# EAGLE design Teensy3.2_v2 (EAGLE 7.6.0)
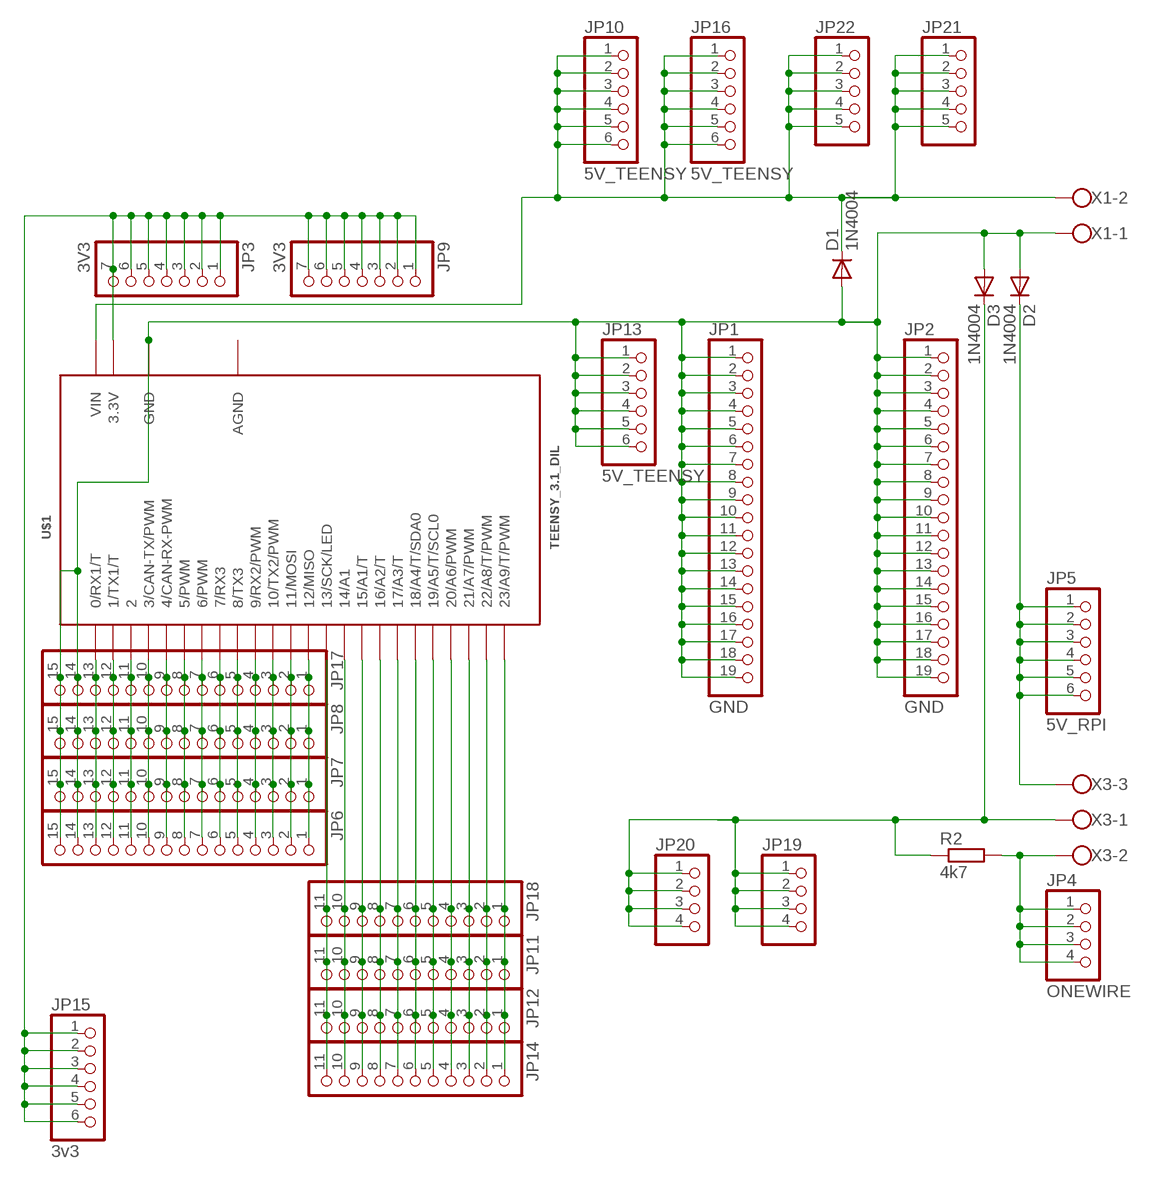
[diagram p0: schematic, sheet 1]

## Parts
D1  1N4004  [DO41-10]
D2  1N4004  [DO41-10]
D3  1N4004  [DO41-10]
JP1  GND  PINHD-1X19  [1X19]
JP2  GND  PINHD-1X19  [1X19]
JP3  3V3  PINHD-1X7  [1X07]
JP4  ONEWIRE  PINHD-1X4  [1X04]
JP5  5V_RPI  PINHD-1X6  [1X06]
JP6  PINHD-1X15  [1X15]
JP7  PINHD-1X15  [1X15]
JP8  PINHD-1X15  [1X15]
JP9  3V3  PINHD-1X7  [1X07]
JP10  5V_TEENSY  PINHD-1X6  [1X06]
JP11  PINHD-1X11  [1X11]
JP12  PINHD-1X11  [1X11]
JP13  5V_TEENSY  PINHD-1X6  [1X06]
JP14  PINHD-1X11  [1X11]
JP15  3v3  PINHD-1X6  [1X06]
JP16  5V_TEENSY  PINHD-1X6  [1X06]
JP17  PINHD-1X15  [1X15]
JP18  PINHD-1X11  [1X11]
JP19  PINHD-1X4  [1X04]
JP20  PINHD-1X4  [1X04]
JP21  PINHD-1X5  [1X05]
JP22  PINHD-1X5  [1X05]
R2  4k7  R-EU_0204/5  [0204/5]
U$1  TEENSY_3.1_DIL  [TEENSY3-DIL]
X1  W237-102  [W237-102]
X3  W237-103  [W237-103]

## Nets
N$1: JP4.1 JP4.2 JP4.3 JP4.4 R2.2 X3.2
N$2: JP3.1 JP3.2 JP3.3 JP3.4 JP3.5 JP3.6 JP3.7 JP9.1 JP9.2 JP9.3 JP9.4 JP9.5 JP9.6 JP9.7 JP15.1 JP15.2 JP15.3 JP15.4 JP15.5 JP15.6 U$1.3.3V
N$3: D3.C JP19.1 JP19.2 JP19.3 JP19.4 JP20.1 JP20.2 JP20.3 JP20.4 R2.1 X3.1
N$4: D1.C JP10.1 JP10.2 JP10.3 JP10.4 JP10.5 JP10.6 JP16.1 JP16.2 JP16.3 JP16.4 JP16.5 JP16.6 JP21.1 JP21.2 JP21.3 JP21.4 JP21.5 JP22.1 JP22.2 JP22.3 JP22.4 JP22.5 U$1.VIN X1.2
N$5: JP6.13 JP7.13 JP8.13 JP17.13 U$1.0(0/RX1/T)
N$6: D1.A D2.A D3.A JP1.1 JP1.2 JP1.3 JP1.4 JP1.5 JP1.6 JP1.7 JP1.8 JP1.9 JP1.10 JP1.11 JP1.12 JP1.13 JP1.14 JP1.15 JP1.16 JP1.17 JP1.18 JP1.19 JP2.1 JP2.2 JP2.3 JP2.4 JP2.5 JP2.6 JP2.7 JP2.8 JP2.9 JP2.10 JP2.11 JP2.12 JP2.13 JP2.14 JP2.15 JP2.16 JP2.17 JP2.18 JP2.19 JP6.14 JP6.15 JP7.14 JP7.15 JP8.14 JP8.15 JP13.1 JP13.2 JP13.3 JP13.4 JP13.5 JP13.6 JP17.14 JP17.15 U$1.GND X1.1
N$7: JP6.11 JP7.11 JP8.11 JP17.11 U$1.2
N$8: JP6.10 JP7.10 JP8.10 JP17.10 U$1.3(3/CAN-TX/PWM)
N$9: JP6.9 JP7.9 JP8.9 JP17.9 U$1.4(4/CAN-RX-PWM)
N$10: JP6.8 JP7.8 JP8.8 JP17.8 U$1.5(5/PWM)
N$11: JP6.7 JP7.7 JP8.7 JP17.7 U$1.6(6/PWM)
N$12: JP6.6 JP7.6 JP8.6 JP17.6 U$1.7(7/RX3)
N$13: JP6.5 JP7.5 JP8.5 JP17.5 U$1.8(8/TX3)
N$14: JP6.4 JP7.4 JP8.4 JP17.4 U$1.9(9/RX2/PWM)
N$15: JP6.3 JP7.3 JP8.3 JP17.3 U$1.10(10/TX2/PWM)
N$16: JP6.2 JP7.2 JP8.2 JP17.2 U$1.11(11/MOSI)
N$18: JP6.1 JP7.1 JP8.1 JP17.1 U$1.12(12/MISO)
N$19: JP11.11 JP12.11 JP14.11 JP18.11 U$1.13(13/SCK/LED)
N$20: JP11.10 JP12.10 JP14.10 JP18.10 U$1.14/A0(14/A1)
N$21: JP11.9 JP12.9 JP14.9 JP18.9 U$1.15/A1(15/A1/T)
N$22: JP11.8 JP12.8 JP14.8 JP18.8 U$1.16/A2(16/A2/T)
N$23: JP11.7 JP12.7 JP14.7 JP18.7 U$1.17/A3(17/A3/T)
N$24: JP11.6 JP12.6 JP14.6 JP18.6 U$1.18/A4(18/A4/T/SDA0)
N$26: JP11.5 JP12.5 JP14.5 JP18.5 U$1.19/A5(19/A5/T/SCL0)
N$27: JP11.4 JP12.4 JP14.4 JP18.4 U$1.20/A6(20/A6/PWM)
N$28: JP11.3 JP12.3 JP14.3 JP18.3 U$1.21/A7(21/A7/PWM)
N$29: JP11.2 JP12.2 JP14.2 JP18.2 U$1.22/A8(22/A8/T/PWM)
N$30: JP11.1 JP12.1 JP14.1 JP18.1 U$1.23/A9(23/A9/T/PWM)
N$31: D2.C JP5.1 JP5.2 JP5.3 JP5.4 JP5.5 JP5.6 X3.3
N$32: JP6.12 JP7.12 JP8.12 JP17.12 U$1.1(1/TX1/T)

## Power pins joined to a net without a drawn wire
AGND: U$1.AGND

## Library data of the parts
D1-D3 = diode:1N4004: DIODE general purpose rectifier, 1 A
JP1 JP2 = pinhead:PINHD-1X19: PIN HEADER
JP3 JP9 = pinhead:PINHD-1X7: PIN HEADER
JP4 JP19 JP20 = pinhead:PINHD-1X4: PIN HEADER
JP5 JP10 JP13 JP15 JP16 = pinhead:PINHD-1X6: PIN HEADER
JP6-JP8 JP17 = pinhead:PINHD-1X15: PIN HEADER
JP11 JP12 JP14 JP18 = pinhead:PINHD-1X11: PIN HEADER
JP21 JP22 = pinhead:PINHD-1X5: PIN HEADER
R2 = rcl:R-EU_: RESISTOR, European symbol
U$1 = Teensy_3_and_LC_Series_Boards_v1.1:TEENSY_3.1_DIL: Teensy 3.1 or 3.2 in a DIL Layout.
X1 = con-wago-500:W237-102: WAGO SCREW CLAMP; MPN: 237-102; OC_FARNELL: unknown; OC_NEWARK: 70K9898
X3 = con-wago-500:W237-103: WAGO SCREW CLAMP; MPN: 237-103; OC_FARNELL: unknown; OC_NEWARK: 18M7116

## Board
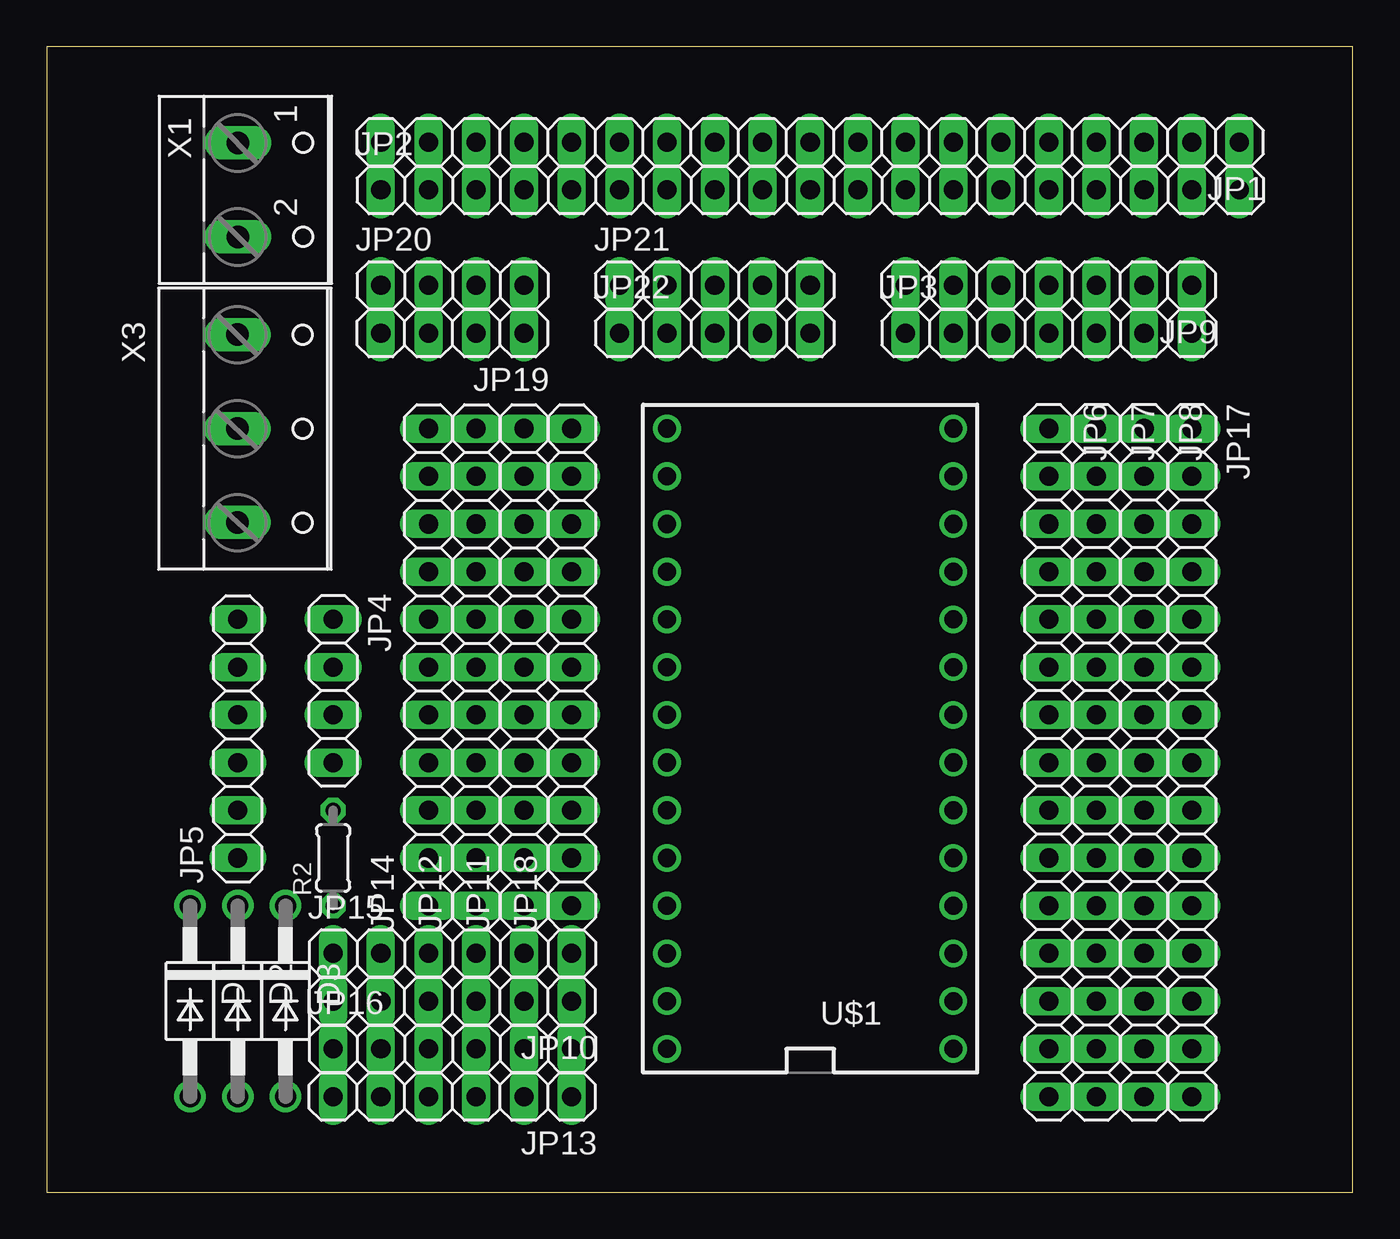
[diagram p1: board, top side]
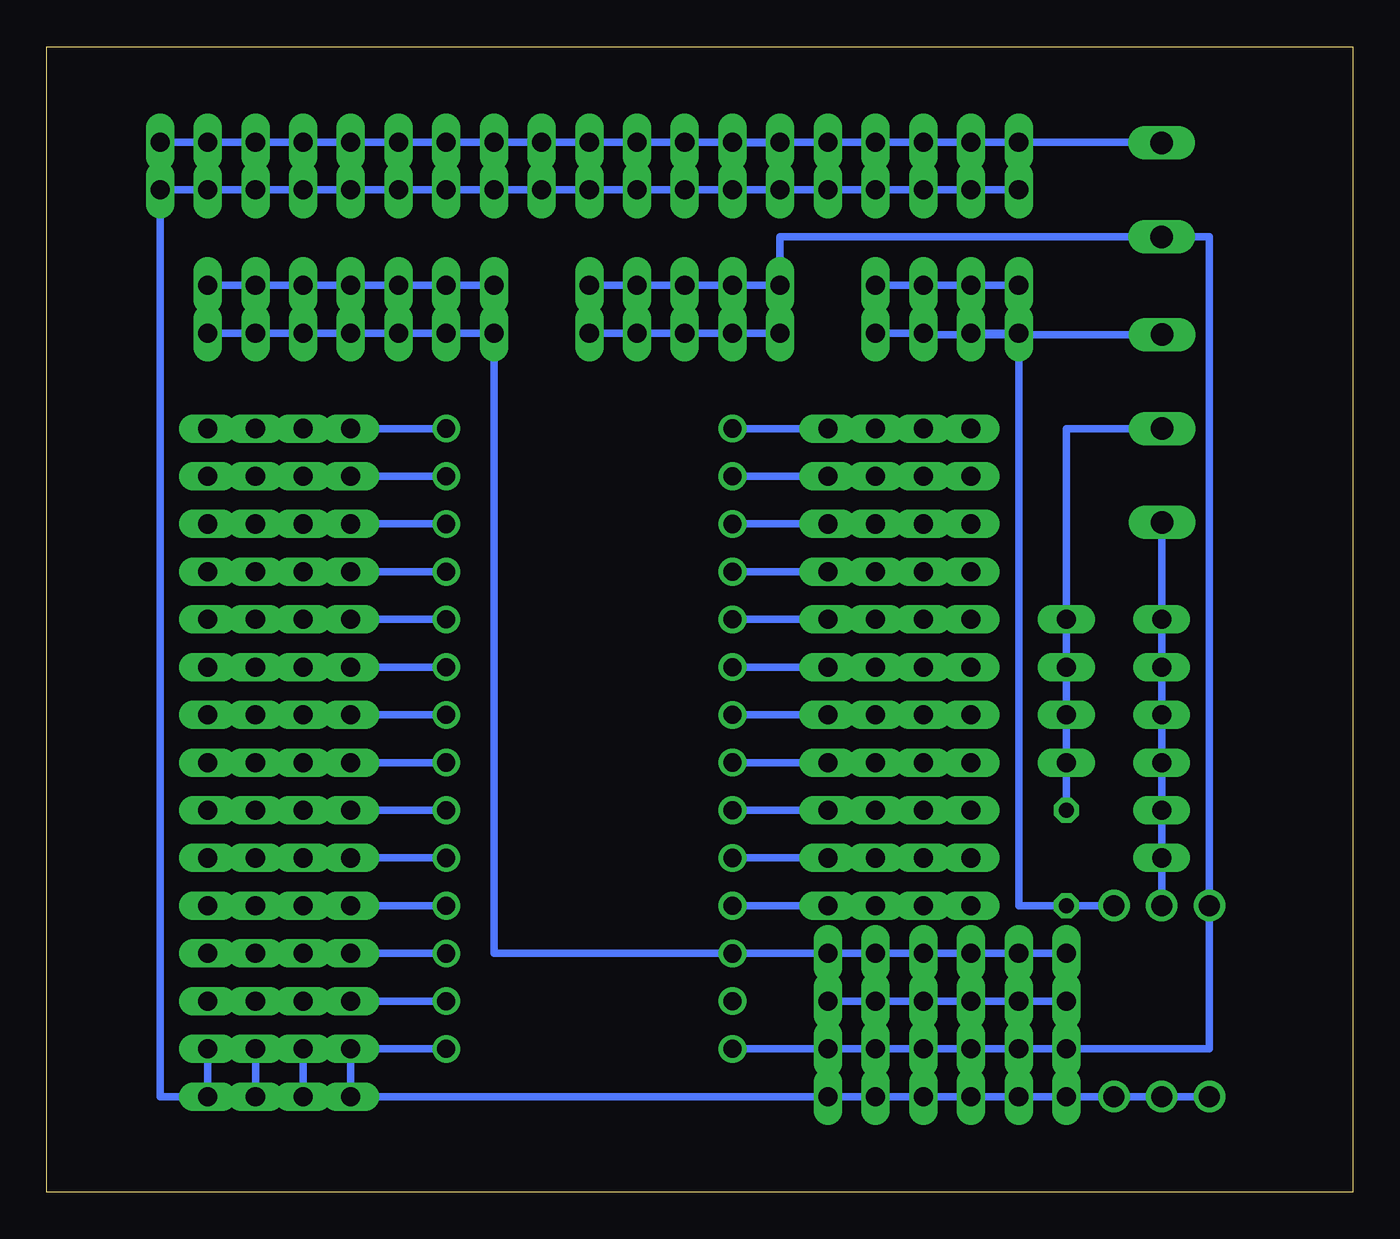
[diagram p2: board, bottom side, seen from below]

Size 69.52 x 60.95 mm. Coordinates in mm from the lower left corner, seen from the top.
Outline: 0,0 69.52,0 69.52,60.95 0,60.95 0,0
Copper layers (1*16): Top 0.035mm / dielectric 1.5mm / Bottom 0.035mm
Design rules "default": minimum track width 10mil, minimum drill 24mil, track to track 8mil, track to pad 8mil, pad to pad 8mil, via to via 8mil, smd to smd 8mil, copper to edge 40mil, drill to drill 8mil, minimum pad ring 10mil, minimum via ring 8mil, stop-mask expansion 4mil, vias tented up to drill 0mil, thermal gap 10mil

### Footprints (pad centres in the part's own frame; a part is rotated, then mirrored left to right if it is on the bottom)
DO41-10 = drill 1.118: A 5.08,0; C -5.08,0
1X19 = drill 1.016 long: 1 -22.86,0; 2 -20.32,0; 3 -17.78,0; 4 -15.24,0; 5 -12.7,0; 6 -10.16,0; 7 -7.62,0; 8 -5.08,0; 9 -2.54,0; 10 0,0; 11 2.54,0; 12 5.08,0; 13 7.62,0; 14 10.16,0; 15 12.7,0; 16 15.24,0; 17 17.78,0; 18 20.32,0; 19 22.86,0
1X07 = drill 1.016 long: 1 -7.62,0; 2 -5.08,0; 3 -2.54,0; 4 0,0; 5 2.54,0; 6 5.08,0; 7 7.62,0
1X04 = drill 1.016 long: 1 -3.81,0; 2 -1.27,0; 3 1.27,0; 4 3.81,0
1X06 = drill 1.016 long: 1 -6.35,0; 2 -3.81,0; 3 -1.27,0; 4 1.27,0; 5 3.81,0; 6 6.35,0
1X15 = drill 1.016 long: 1 -17.78,0; 2 -15.24,0; 3 -12.7,0; 4 -10.16,0; 5 -7.62,0; 6 -5.08,0; 7 -2.54,0; 8 0,0; 9 2.54,0; 10 5.08,0; 11 7.62,0; 12 10.16,0; 13 12.7,0; 14 15.24,0; 15 17.78,0
1X11 = drill 1.016 long: 1 -12.7,0; 2 -10.16,0; 3 -7.62,0; 4 -5.08,0; 5 -2.54,0; 6 0,0; 7 2.54,0; 8 5.08,0; 9 7.62,0; 10 10.16,0; 11 12.7,0
1X05 = drill 1.016 long: 1 -5.08,0; 2 -2.54,0; 3 0,0; 4 2.54,0; 5 5.08,0
0204/5 = drill 0.813 octagon: 1 -2.54,0; 2 2.54,0
TEENSY3-DIL = drill 0.965: 0 -7.62,13.97; 1 -7.62,11.43; 2 -7.62,8.89; 3 -7.62,6.35; 3.3V 7.62,11.43; 4 -7.62,3.81; 5 -7.62,1.27; 6 -7.62,-1.27; 7 -7.62,-3.81; 8 -7.62,-6.35; 9 -7.62,-8.89; 10 -7.62,-11.43; 11 -7.62,-13.97; 12 -7.62,-16.51; 13 7.62,-16.51; 14/A0 7.62,-13.97; 15/A1 7.62,-11.43; 16/A2 7.62,-8.89; 17/A3 7.62,-6.35; 18/A4 7.62,-3.81; 19/A5 7.62,-1.27; 20/A6 7.62,1.27; 21/A7 7.62,3.81; 22/A8 7.62,6.35; 23/A9 7.62,8.89; AGND 7.62,13.97; GND -7.62,16.51; VIN 7.62,16.51
W237-102 = drill 1.194 long: 1 -2.5,-1.27; 2 2.5,-1.27
W237-103 = drill 1.194 long: 1 -5,-1.29; 2 0,-1.29; 3 5,-1.29

### Placement (x,y rotation side)
D1  7.62,10.16 270 top
D2  10.16,10.16 270 top
D3  12.7,10.16 270 top
JP1  40.64,55.88 180 top
JP2  40.64,53.34 0 top
JP3  53.34,45.72 0 top
JP4  15.24,26.67 270 top
JP5  10.16,24.13 90 top
JP6  53.34,22.86 270 top
JP7  55.88,22.86 270 top
JP8  58.42,22.86 270 top
JP9  53.34,48.26 180 top
JP10  21.59,10.16 180 top
JP11  25.4,27.94 90 top
JP12  22.86,27.94 90 top
JP13  21.59,5.08 180 top
JP14  20.32,27.94 90 top
JP15  21.59,12.7 0 top
JP16  21.59,7.62 0 top
JP17  60.96,22.86 270 top
JP18  27.94,27.94 90 top
JP19  21.59,45.72 180 top
JP20  21.59,48.26 0 top
JP21  35.56,48.26 0 top
JP22  35.56,45.72 0 top
R2  15.24,17.78 90 top
U$1  40.64,24.13 180 top
X1  11.43,53.34 270 top
X3  11.43,40.64 270 top

### Tracks (layer width: path | path; a pad name or v marks a point on that pad's centre or on a via)
N$1
  Bottom 0.406: X3.2 15.24,40.64 JP4.1 JP4.2 R2.2 JP4.4 JP4.3
N$2
  Bottom 0.406: JP9.7 JP9.6 JP9.5 JP9.4 JP9.3 JP9.2 JP9.1 JP3.7 JP3.6 JP3.5 JP3.4 JP3.3 JP3.2 JP3.1 45.72,12.7 U$1.3.3V JP15.6 JP15.5 JP15.4 JP15.3 JP15.2 JP15.1
N$3
  Bottom 0.406: 10.14,45.72 X3.1 17.78,45.64 | D3.C R2.1 17.78,15.24 17.78,45.64 | 17.78,45.64 JP19.4 | JP19.4 JP20.1 JP20.2 JP20.3 JP20.4 | JP19.4 JP19.3 | 17.78,45.64 22.86,45.64 JP19.2 JP19.1
N$4
  Bottom 0.406: JP16.1 7.62,7.62 D1.C 7.62,50.84 X1.2 30.48,50.84 JP21.1 | U$1.VIN JP16.6 JP16.5 JP16.4 JP16.3 JP16.2 JP16.1 | JP21.1 JP21.2 JP21.3 JP21.4 JP21.5 | JP21.1 JP22.1 JP22.2 JP22.3 JP22.4 JP22.5 | JP16.1 JP10.6 JP10.5 JP10.4 JP10.3 JP10.2 JP10.1
N$5
  Bottom 0.406: U$1.0 JP6.13 JP7.13 JP8.13 JP17.13
N$6
  Bottom 0.406: 33.02,55.84 30.48,55.84 JP1.6 | JP6.14 JP6.15 JP13.1 JP13.2 JP13.3 JP13.4 JP13.5 JP13.6 D3.A D2.A D1.A | JP7.15 JP7.14 | JP8.14 JP8.15 JP17.15 | U$1.GND JP6.14 | JP1.1 JP1.2 JP1.3 JP1.4 JP1.5 JP1.6 | JP1.6 JP1.7 JP1.8 JP1.9 JP1.10 JP1.11 JP1.12 JP1.13 JP1.14 JP1.15 JP1.16 JP1.17 JP1.18 JP1.19 | JP6.14 JP7.14 | JP7.14 JP8.14 | JP1.19 JP2.1 JP2.2 JP2.3 JP2.4 JP2.5 JP2.6 JP2.7 JP2.8 JP2.9 JP2.10 JP2.11 JP2.12 JP2.13 JP2.14 JP2.15 JP2.16 JP2.17 JP2.18 JP2.19 63.5,5.08 JP17.15 | X1.1 10.16,55.88 JP1.19 | JP8.14 JP17.14 JP17.15
N$7
  Bottom 0.406: U$1.2 JP6.11 JP7.11 JP8.11 JP17.11
N$8
  Bottom 0.406: U$1.3 JP6.10 JP7.10 JP8.10 JP17.10
N$9
  Bottom 0.406: U$1.4 JP6.9 JP7.9 JP8.9 JP17.9
N$10
  Bottom 0.406: U$1.5 JP6.8 JP7.8 JP8.8 JP17.8
N$11
  Bottom 0.406: U$1.6 JP6.7 JP7.7 JP8.7 JP17.7
N$12
  Bottom 0.406: U$1.7 JP6.6 JP7.6 JP8.6 JP17.6
N$13
  Bottom 0.406: U$1.8 JP6.5 JP7.5 JP8.5 JP17.5
N$14
  Bottom 0.406: U$1.9 JP6.4 JP7.4 JP8.4 JP17.4
N$15
  Bottom 0.406: U$1.10 JP6.3 JP7.3 JP8.3 JP17.3
N$16
  Bottom 0.406: U$1.11 JP6.2 JP7.2 JP8.2 JP17.2
N$18
  Bottom 0.406: U$1.12 JP6.1 JP7.1 JP8.1 JP17.1
N$19
  Bottom 0.406: U$1.13 JP18.11 JP11.11 JP12.11 JP14.11
N$20
  Bottom 0.406: JP14.10 JP12.10 JP11.10 JP18.10 U$1.14/A0
N$21
  Bottom 0.406: U$1.15/A1 JP18.9 JP11.9 | 24.13,35.56 JP11.9 | JP11.9 JP12.9 JP14.9
N$22
  Bottom 0.406: U$1.16/A2 JP18.8 JP11.8 JP12.8 JP14.8
N$23
  Bottom 0.406: U$1.17/A3 JP18.7 JP11.7 JP12.7 JP14.7
N$24
  Bottom 0.406: U$1.18/A4 JP18.6 JP11.6 JP12.6 JP14.6
N$26
  Bottom 0.406: JP14.5 JP12.5 JP11.5 JP18.5 U$1.19/A5
N$27
  Bottom 0.406: U$1.20/A6 JP18.4 JP11.4 JP12.4 JP14.4
N$28
  Bottom 0.406: JP14.3 JP12.3 | 24.13,20.32 JP12.3 | JP12.3 JP11.3 JP18.3 U$1.21/A7
N$29
  Bottom 0.406: JP14.2 JP12.2 JP11.2 JP18.2 U$1.22/A8
N$30
  Bottom 0.406: JP14.1 JP12.1 JP11.1 JP18.1 U$1.23/A9
N$31
  Bottom 0.406: X3.3 10.16,35.64 JP5.6 JP5.5 JP5.4 JP5.3 JP5.2 JP5.1 D2.C
N$32
  Bottom 0.406: U$1.1 JP6.12 JP7.12 JP8.12 JP17.12